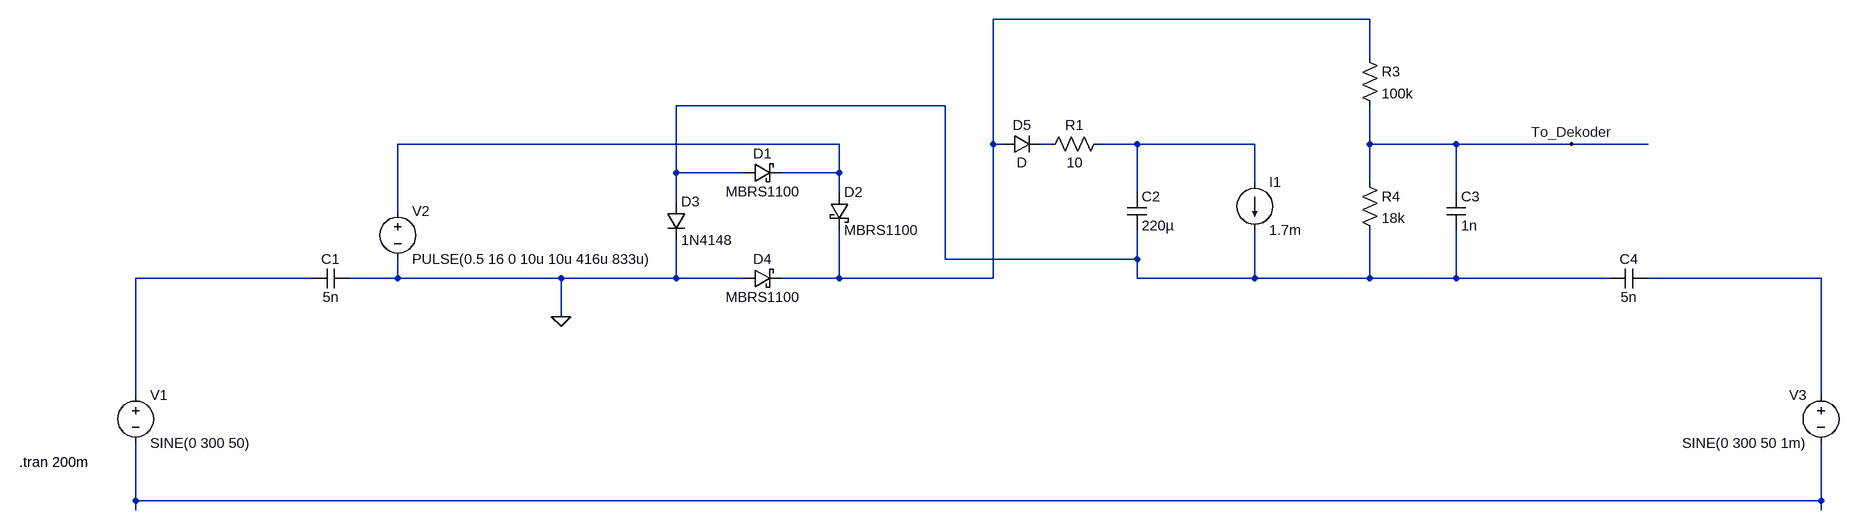
[diagram p0: schematic Floating_AC_Noise.asc]
Floating_AC_Noise.asc, the LTspice schematic file:
Version 4
SHEET 1 3492 680
WIRE 2544 -528 1616 -528
WIRE 2544 -464 2544 -528
WIRE 1536 -384 1088 -384
WIRE 1360 -320 624 -320
WIRE 1616 -320 1616 -528
WIRE 1632 -320 1616 -320
WIRE 1712 -320 1696 -320
WIRE 1856 -320 1792 -320
WIRE 2144 -320 1856 -320
WIRE 2544 -320 2544 -384
WIRE 2688 -320 2544 -320
WIRE 2880 -320 2688 -320
WIRE 3008 -320 2880 -320
WIRE 1088 -272 1088 -384
WIRE 1200 -272 1088 -272
WIRE 1360 -272 1360 -320
WIRE 1360 -272 1264 -272
WIRE 2144 -256 2144 -320
WIRE 2544 -256 2544 -320
WIRE 1360 -240 1360 -272
WIRE 1856 -240 1856 -320
WIRE 2688 -240 2688 -320
WIRE 1088 -224 1088 -272
WIRE 624 -208 624 -320
WIRE 1536 -128 1536 -384
WIRE 1856 -128 1856 -176
WIRE 1856 -128 1536 -128
WIRE 480 -96 32 -96
WIRE 624 -96 624 -128
WIRE 624 -96 544 -96
WIRE 896 -96 624 -96
WIRE 1088 -96 1088 -160
WIRE 1088 -96 896 -96
WIRE 1200 -96 1088 -96
WIRE 1360 -96 1360 -176
WIRE 1360 -96 1264 -96
WIRE 1616 -96 1616 -320
WIRE 1616 -96 1360 -96
WIRE 1856 -96 1856 -128
WIRE 2144 -96 2144 -176
WIRE 2144 -96 1856 -96
WIRE 2544 -96 2544 -176
WIRE 2544 -96 2144 -96
WIRE 2688 -96 2688 -176
WIRE 2688 -96 2544 -96
WIRE 2944 -96 2688 -96
WIRE 3296 -96 3008 -96
WIRE 896 -32 896 -96
WIRE 32 160 32 -96
WIRE 3296 160 3296 -96
WIRE 32 336 32 240
WIRE 3296 336 3296 240
WIRE 3296 336 32 336
WIRE 32 352 32 336
WIRE 3296 352 3296 336
FLAG 2880 -320 To_Dekoder
FLAG 896 -32 0
SYMBOL voltage 32 144 R0
WINDOW 123 0 0 Left 0
WINDOW 39 0 0 Left 0
SYMATTR InstName V1
SYMATTR Value SINE(0 300 50)
SYMBOL cap 544 -112 R90
WINDOW 0 0 32 VBottom 2
WINDOW 3 32 32 VTop 2
SYMATTR InstName C1
SYMATTR Value 5n
SYMBOL voltage 624 -224 R0
WINDOW 123 0 0 Left 0
WINDOW 39 0 0 Left 0
SYMATTR InstName V2
SYMATTR Value PULSE(0.5 16 0 10u 10u 416u 833u)
SYMBOL schottky 1200 -256 R270
WINDOW 0 32 32 VTop 2
WINDOW 3 0 32 VBottom 2
SYMATTR InstName D1
SYMATTR Value MBRS1100
SYMATTR Description Diode
SYMATTR Type diode
SYMBOL cap 1840 -240 R0
SYMATTR InstName C2
SYMATTR Value 220µ
SYMBOL res 1808 -336 R90
WINDOW 0 0 56 VBottom 2
WINDOW 3 32 56 VTop 2
SYMATTR InstName R1
SYMATTR Value 10
SYMBOL current 2144 -256 R0
WINDOW 123 0 0 Left 0
WINDOW 39 0 0 Left 0
SYMATTR InstName I1
SYMATTR Value 1.7m
SYMBOL schottky 1344 -240 R0
SYMATTR InstName D2
SYMATTR Value MBRS1100
SYMATTR Description Diode
SYMATTR Type diode
SYMBOL diode 1072 -224 R0
SYMATTR InstName D3
SYMATTR Value 1N4148
SYMBOL schottky 1200 -80 R270
WINDOW 0 32 32 VTop 2
WINDOW 3 0 32 VBottom 2
SYMATTR InstName D4
SYMATTR Value MBRS1100
SYMATTR Description Diode
SYMATTR Type diode
SYMBOL diode 1632 -304 R270
WINDOW 0 32 32 VTop 2
WINDOW 3 0 32 VBottom 2
SYMATTR InstName D5
SYMBOL res 2528 -480 R0
SYMATTR InstName R3
SYMATTR Value 100k
SYMBOL res 2528 -272 R0
SYMATTR InstName R4
SYMATTR Value 18k
SYMBOL cap 2672 -240 R0
SYMATTR InstName C3
SYMATTR Value 1n
SYMBOL voltage 3296 144 M0
WINDOW 123 0 0 Left 0
WINDOW 39 0 0 Left 0
SYMATTR InstName V3
SYMATTR Value SINE(0 300 50 1m)
SYMBOL cap 2944 -112 M90
WINDOW 0 0 32 VBottom 2
WINDOW 3 32 32 VTop 2
SYMATTR InstName C4
SYMATTR Value 5n
TEXT -162 272 Left 2 !.tran 200m

The netlist it stands for:
* Floating_AC_Noise.asc
V1 N006 N008 SINE(0 300 50)
C1 0 N006 5n
V2 N003 0 PULSE(0.5 16 0 10u 10u 416u 833u)
D1 N002 N003 MBRS1100
C2 N005 N002 220µ
R1 N005 N004 10
I1 N005 N002 1.7m
D2 N003 N001 MBRS1100
D3 N002 0 1N4148
D4 0 N001 MBRS1100
D5 N001 N004 D
R3 N001 To_Dekoder 100k
R4 To_Dekoder N002 18k
C3 To_Dekoder N002 1n
V3 N007 N008 SINE(0 300 50 1m)
C4 N002 N007 5n
.model D D
.lib standard.dio
.tran 200m
.backanno
.end